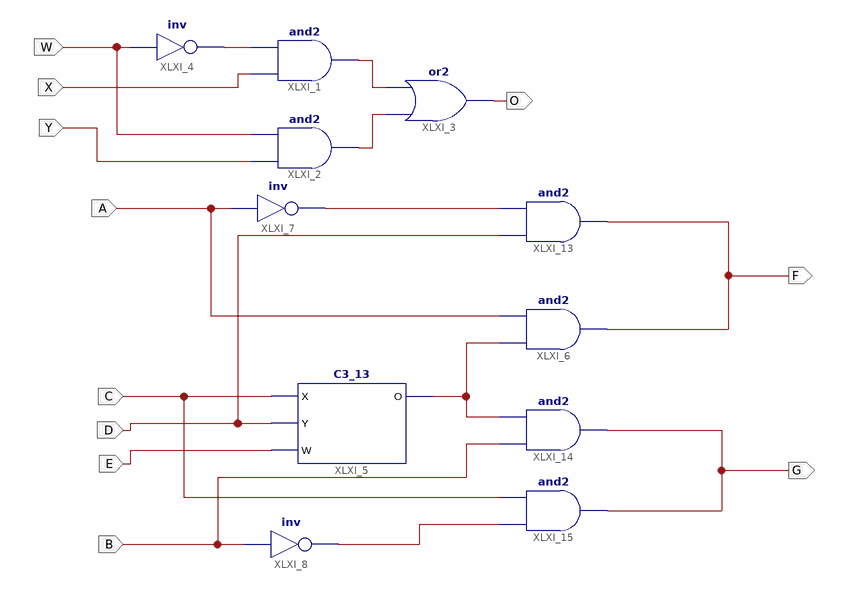
[diagram p0: schematic sheet 1]
// Xilinx ISE schematic C3_13.sch (kintex7) as structural Verilog: 11 symbols, 11 ports
module C3_13 (
  input  X,
  input  Y,
  input  W,
  input  C,
  input  D,
  input  E,
  input  A,
  input  B,
  output O,
  output F,
  output G
);

  wire XLXN_1, XLXN_2, XLXN_3, XLXN_39, XLXN_40, XLXN_46;

  and XLXI_1 (XLXN_1, X, XLXN_3);
  and XLXI_2 (XLXN_2, Y, W);
  or XLXI_3 (O, XLXN_2, XLXN_1);
  not XLXI_4 (XLXN_3, W);
  C3_13 XLXI_5 (.X(C), .Y(D), .W(E), .O(XLXN_39));
  and XLXI_6 (F, XLXN_39, A);
  not XLXI_7 (XLXN_40, A);
  and XLXI_13 (F, D, XLXN_40);
  and XLXI_14 (G, B, XLXN_39);
  and XLXI_15 (G, XLXN_46, C);
  not XLXI_8 (XLXN_46, B);
endmodule
